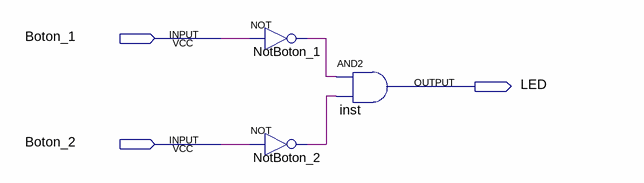
[diagram p0: schematic sheet]
// Quartus schematic Primer_proyecto.bdf as structural Verilog: 3 symbols, 3 pins
module Primer_proyecto (
  input  Boton_1,
  input  Boton_2,
  output LED
);

  wire NotBoton_1_out, NotBoton_2_out;

  not NotBoton_1 (NotBoton_1_out, Boton_1);
  not NotBoton_2 (NotBoton_2_out, Boton_2);
  and inst (LED, NotBoton_1_out, NotBoton_2_out);
endmodule
